# Altium project PCB_Project1.PrjPCB
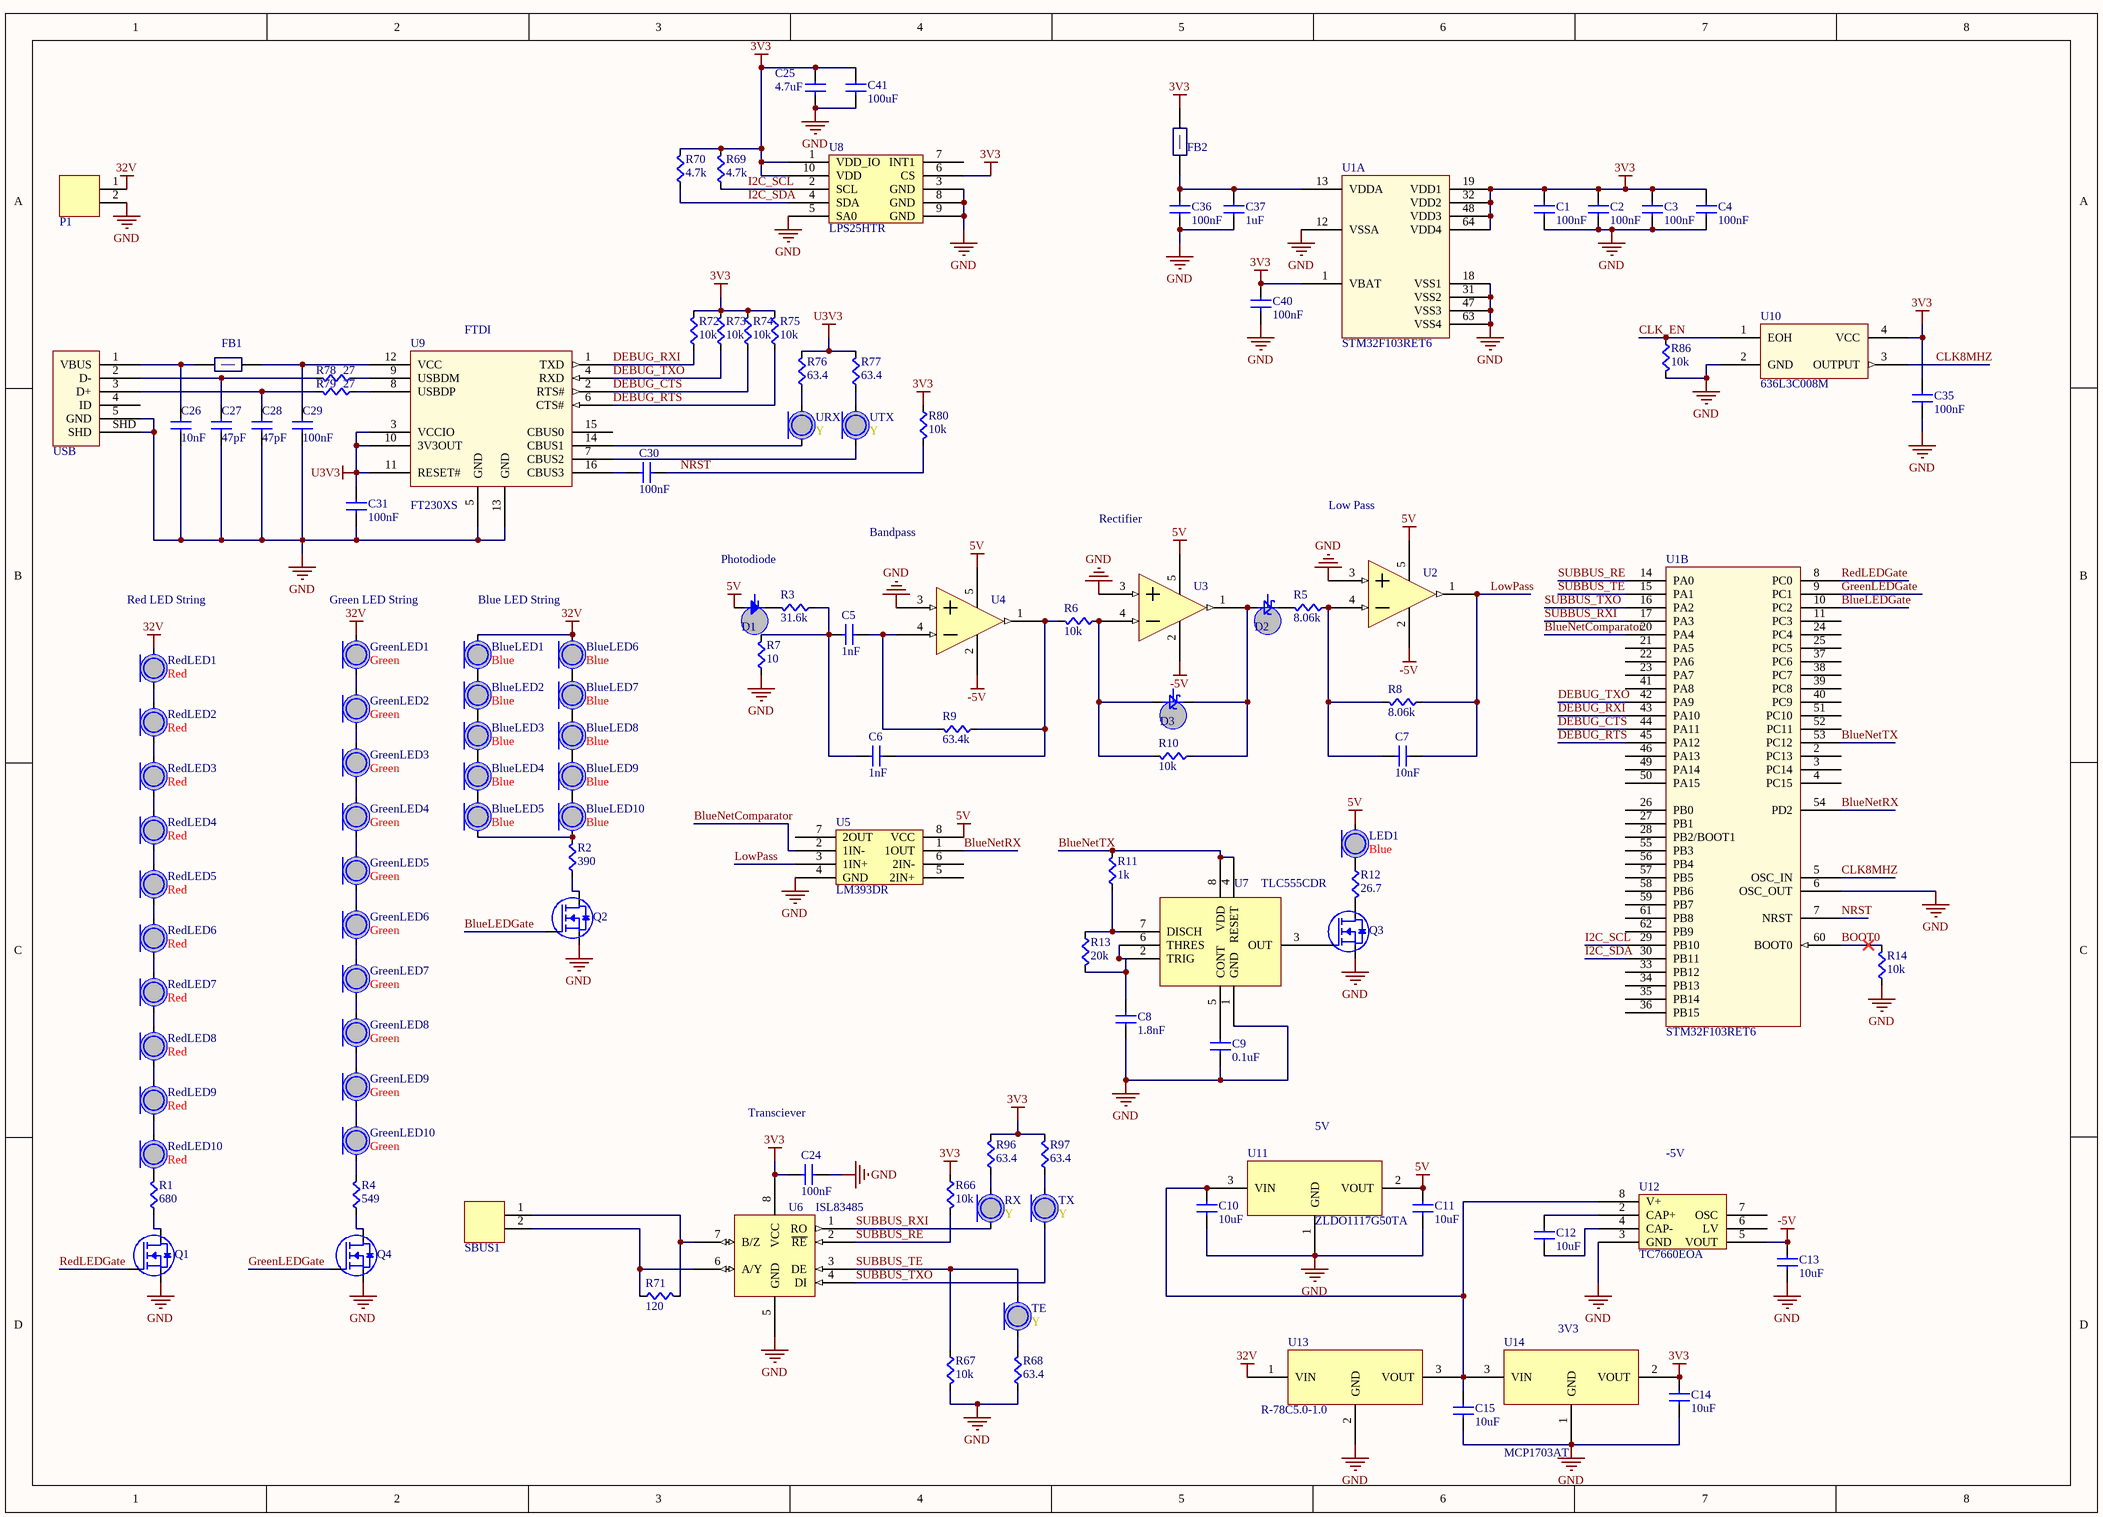
[diagram p0: DiverInterfaceBoard.SchDoc]
1 sheet, 122 parts. Net scope: global (net labels, ports and power ports of the same name join across sheets).
Board file: DiverInterfaceBoard.PcbDoc

## Sheet DiverInterfaceBoard.SchDoc
size A3

### Parts
BlueLED1  Color: Blue  [LED1206]  (hidden comment: LED)
BlueLED2  Color: Blue  [LED1206]  (hidden comment: LED)
BlueLED3  Color: Blue  [LED1206]  (hidden comment: LED)
BlueLED4  Color: Blue  [LED1206]  (hidden comment: LED)
BlueLED5  Color: Blue  [LED1206]  (hidden comment: LED)
BlueLED6  Color: Blue  [LED1206]  (hidden comment: LED)
BlueLED7  Color: Blue  [LED1206]  (hidden comment: LED)
BlueLED8  Color: Blue  [LED1206]  (hidden comment: LED)
BlueLED9  Color: Blue  [LED1206]  (hidden comment: LED)
BlueLED10  Color: Blue  [LED1206]  (hidden comment: LED)
C1  value 100nF  [CAPC0603]  (hidden comment: Cap)
C2  value 100nF  [CAPC0603]  (hidden comment: Cap)
C3  value 100nF  [CAPC0603]  (hidden comment: Cap)
C4  value 100nF  [CAPC0603]  (hidden comment: Cap)
C5  value 1nF  [CAPC0603]  (hidden comment: Cap)
C6  value 1nF  [CAPC0603]  (hidden comment: Cap)
C7  value 10nF  [CAPC0603]  (hidden comment: Cap)
C8  value 1.8nF  [CAPC0603]  (hidden comment: Cap)
C9  value 0.1uF  [CAPC0603]  (hidden comment: Cap)
C10  value 10uF  [CAPC0603]  (hidden comment: Cap)
C11  value 10uF  [CAPC0603]  (hidden comment: Cap)
C12  value 10uF  [CAPC0603]  (hidden comment: Cap)
C13  value 10uF  [CAPC0603]  (hidden comment: Cap)
C14  value 10uF  [CAPC0603]  (hidden comment: Cap)
C15  value 10uF  [CAPC0603]  (hidden comment: Cap)
C24  value 100nF  [CAPC0603]  (hidden comment: Cap)
C25  value 4.7uF  [CAPC0603]  (hidden comment: Cap)
C26  value 10nF  [CAPC0603]  (hidden comment: Cap)
C27  value 47pF  [CAPC0603]  (hidden comment: Cap)
C28  value 47pF  [CAPC0603]  (hidden comment: Cap)
C29  value 100nF  [CAPC0603]  (hidden comment: Cap)
C30  value 100nF  [CAPC0603]  (hidden comment: Cap)
C31  value 100nF  [CAPC0603]  (hidden comment: Cap)
C35  value 100nF  [CAPC0603]  (hidden comment: Cap)
C36  value 100nF  [CAPC0603]  (hidden comment: Cap)
C37  value 1uF  [CAPC0603]  (hidden comment: Cap)
C40  value 100nF  [CAPC0603]  (hidden comment: Cap)
C41  value 100uF  [CAPC1206]  (hidden comment: Cap)
D1  Diode  [TEMD5510FX01]  (value not drawn)
D2  Schottky  [1N5819HW-7-F]  (value not drawn)
D3  Schottky  [1N5819HW-7-F]  (value not drawn)
FB1  FBead  [RES0603]  (value not drawn)
FB2  FBead  [RES0603]  (value not drawn)
GreenLED1  Color: Green  [LED1206]  (hidden comment: LED)
GreenLED2  Color: Green  [LED1206]  (hidden comment: LED)
GreenLED3  Color: Green  [LED1206]  (hidden comment: LED)
GreenLED4  Color: Green  [LED1206]  (hidden comment: LED)
GreenLED5  Color: Green  [LED1206]  (hidden comment: LED)
GreenLED6  Color: Green  [LED1206]  (hidden comment: LED)
GreenLED7  Color: Green  [LED1206]  (hidden comment: LED)
GreenLED8  Color: Green  [LED1206]  (hidden comment: LED)
GreenLED9  Color: Green  [LED1206]  (hidden comment: LED)
GreenLED10  Color: Green  [LED1206]  (hidden comment: LED)
LED1  Color: Blue  [LED0603]  (hidden comment: LED)
P1  2-pin Vert Sherlock  [MOLEX-HDR-1X2-SHERLOCK-VERT]  (value not drawn)
Q1  FDN5630  [PowerSOT-3]  (value not drawn)
Q2  FDN5630  [PowerSOT-3]  (value not drawn)
Q3  FDN5630  [PowerSOT-3]  (value not drawn)
Q4  FDN5630  [PowerSOT-3]  (value not drawn)
R1  value 680  [RES0603]  (hidden comment: Res)
R2  value 390  [RES0603]  (hidden comment: Res)
R3  value 31.6k  [RES0603]  (hidden comment: Res)
R4  value 549  [RES0603]  (hidden comment: Res)
R5  value 8.06k  [RES0603]  (hidden comment: Res)
R6  value 10k  [RES0603]  (hidden comment: Res)
R7  value 10  [RES0603]  (hidden comment: Res)
R8  value 8.06k  [RES0603]  (hidden comment: Res)
R9  value 63.4k  [RES0603]  (hidden comment: Res)
R10  value 10k  [RES0603]  (hidden comment: Res)
R11  value 1k  [RES0603]  (hidden comment: Res)
R12  value 26.7  [RES0603]  (hidden comment: Res)
R13  value 20k  [RES0603]  (hidden comment: Res)
R14  value 10k  [RES0603]  (hidden comment: Res)
R66  value 10k  [RES0603]  (hidden comment: Res)
R67  value 10k  [RES0603]  (hidden comment: Res)
R68  value 63.4  [RES0603]  (hidden comment: Res)
R69  value 4.7k  [RES0603]  (hidden comment: Res)
R70  value 4.7k  [RES0603]  (hidden comment: Res)
R71  value 120  [RES0603]  (hidden comment: Res)
R72  value 10k  [RES0603]  (hidden comment: Res)
R73  value 10k  [RES0603]  (hidden comment: Res)
R74  value 10k  [RES0603]  (hidden comment: Res)
R75  value 10k  [RES0603]  (hidden comment: Res)
R76  value 63.4  [RES0603]  (hidden comment: Res)
R77  value 63.4  [RES0603]  (hidden comment: Res)
R78  value 27  [RES0603]  (hidden comment: Res)
R79  value 27  [RES0603]  (hidden comment: Res)
R80  value 10k  [RES0603]  (hidden comment: Res)
R86  value 10k  [RES0603]  (hidden comment: Res)
R96  value 63.4  [RES0603]  (hidden comment: Res)
R97  value 63.4  [RES0603]  (hidden comment: Res)
RedLED1  Color: Red  [LED1206]  (hidden comment: LED)
RedLED2  Color: Red  [LED1206]  (hidden comment: LED)
RedLED3  Color: Red  [LED1206]  (hidden comment: LED)
RedLED4  Color: Red  [LED1206]  (hidden comment: LED)
RedLED5  Color: Red  [LED1206]  (hidden comment: LED)
RedLED6  Color: Red  [LED1206]  (hidden comment: LED)
RedLED7  Color: Red  [LED1206]  (hidden comment: LED)
RedLED8  Color: Red  [LED1206]  (hidden comment: LED)
RedLED9  Color: Red  [LED1206]  (hidden comment: LED)
RedLED10  Color: Red  [LED1206]  (hidden comment: LED)
RX  Color: Y  [LED0805]  (hidden comment: LED)
SBUS1  2-pin Horz Sherlock  [MOLEX-HDR-1X2-SHERLOCK-HORZ]  (value not drawn)
TE  Color: Y  [LED0805]  (hidden comment: LED)
TX  Color: Y  [LED0805]  (hidden comment: LED)
U1  STM32F103RET6  [STM32F103RxTx]  (parts A,B of 2)
U2  MCP6L01  [MCP6L01R]  (value not drawn)
U3  MCP6L01  [MCP6L01R]  (value not drawn)
U4  MCP6L01  [MCP6L01R]  (value not drawn)
U5  LM393DR  [LM393DR]
U6  ISL83485  [ISL8348xIBZ]
U7  TLC555CDR  [TLC555CDR]
U8  LPS25HTR  [LPS25HTR]
U9  FT230XS  [FT230XS]
U10  636L3C008M  [636L3C]
U11  ZLDO1117G50TA  [ZLDO1117G50TA]
U12  TC7660EOA  [TC7660EOA]
U13  R-78C5.0-1.0  [R-78C5.0-1.0]
U14  MCP1703AT  [MCP1703AT-xx02EDB]
URX  Color: Y  [LED0805]  (hidden comment: LED)
USB  UX60SC-MB-5ST  [UX60SC-MB-5ST]  (value not drawn)
UTX  Color: Y  [LED0805]  (hidden comment: LED)

### Nets
3V3: C1.1(A) C2.1(A) C3.1(A) C4.1(A) C14.1(A) C24.2(B) C25.1(A) C35.1(A) C40.1(A) C41.1(A) FB2.2(B) R66.1(A) R69.1(A) R70.1(A) R72.1(A) R73.1(A) R74.1(A) R75.1(A) R80.1(A) R96.1(A) R97.1(A) U1.1(VBAT) U1.19(VDD1) U1.32(VDD2) U1.48(VDD3) U1.64(VDD4) U6.8(VCC) U8.1(VDD_IO) U8.6(CS) U8.10(VDD) U10.4(VCC) U14.2(VOUT)
5V: C11.1(A) D1.A LED1.A U2.5(VDD) U3.5(VDD) U4.5(VDD) U5.8(VCC) U11.2(VOUT)
32V: BlueLED1.A BlueLED6.A GreenLED1.A P1.1 RedLED1.A U13.1(VIN)
-5V: C13.1(A) U2.2(VSS) U3.2(VSS) U4.2(VSS) U12.5(VOUT)
GND: C1.2(B) C2.2(B) C3.2(B) C4.2(B) C8.2(B) C9.2(B) C10.2(B) C11.2(B) C13.2(B) C14.2(B) C15.2(B) C24.1(A) C25.2(B) C26.2(B) C27.2(B) C28.2(B) C29.2(B) C31.2(B) C35.2(B) C36.2(B) C37.2(B) C40.2(B) C41.2(B) P1.2 Q1.S Q2.S Q3.S Q4.S R7.2(B) R14.2(B) R67.2(B) R68.2(B) R86.1(A) U1.6(OSC_OUT) U1.12(VSSA) U1.18(VSS1) U1.31(VSS2) U1.47(VSS3) U1.63(VSS4) U2.3(VIN+) U3.3(VIN+) U4.3(VIN+) U5.4(GND) U6.5(GND) U7.1(GND) U8.3(GND) U8.5(SA0) U8.8(GND) U8.9(GND) U9.5(GND) U9.13(GND) U10.2(GND) U11.1(GND) U12.3(GND) U13.2(GND) U14.1(GND) USB.5(GND) USB.SHD
U3V3: C31.1(A) R76.1(A) R77.1(A) U9.3(VCCIO) U9.10(3V3OUT) U9.11(RESET#)
BlueLEDGate: Q2.G U1.10(PC2)
BlueNetComparator: U1.20(PA4) U5.2(1IN-)
BlueNetRX: U1.54(PD2) U5.1(1OUT)
BlueNetTX: R11.1(A) U1.53(PC12) U7.4(RESET) U7.8(VDD)
BOOT0: R14.1(A) U1.60(BOOT0)
CLK8MHZ: U1.5(OSC_IN) U10.3(OUTPUT)
CLK_EN: R86.2(B) U10.1(EOH)
DEBUG_CTS: R74.2(B) U1.44(PA11) U9.2(RTS#)
DEBUG_RTS: R75.2(B) U1.45(PA12) U9.6(CTS#)
DEBUG_RXI: R72.2(B) U1.43(PA10) U9.1(TXD)
DEBUG_TXO: R73.2(B) U1.42(PA9) U9.4(RXD)
GreenLEDGate: Q4.G U1.9(PC1)
I2C_SCL: R69.2(B) U1.29(PB10) U8.2(SCL)
I2C_SDA: R70.2(B) U1.30(PB11) U8.4(SDA)
LowPass: C7.2(B) R8.2(B) U2.1(VOUT) U5.3(1IN+)
NRST: C30.2(B) R80.2(B) U1.7(NRST)
RedLEDGate: Q1.G U1.8(PC0)
SUBBUS_RE: R66.2(B) U1.14(PA0) U6.2(~{RE})
SUBBUS_RXI: RX.C U1.17(PA3) U6.1(RO)
SUBBUS_TE: R67.1(A) TE.A U1.15(PA1) U6.3(DE)
SUBBUS_TXO: TX.C U1.16(PA2) U6.4(DI)
NetBlueLED1_C: BlueLED1.C BlueLED2.A
NetBlueLED2_C: BlueLED2.C BlueLED3.A
NetBlueLED3_C: BlueLED3.C BlueLED4.A
NetBlueLED4_C: BlueLED4.C BlueLED5.A
NetBlueLED5_C: BlueLED5.C BlueLED10.C R2.1(A)
NetBlueLED6_C: BlueLED6.C BlueLED7.A
NetBlueLED7_C: BlueLED7.C BlueLED8.A
NetBlueLED8_C: BlueLED8.C BlueLED9.A
NetBlueLED9_C: BlueLED9.C BlueLED10.A
NetC5_1: C5.1(A) C6.1(A) R3.2(B) R7.1(A)
NetC5_2: C5.2(B) R9.1(A) U4.4(VIN-)
NetC6_2: C6.2(B) R6.1(A) R9.2(B) U4.1(VOUT)
NetC7_1: C7.1(A) R5.2(B) R8.1(A) U2.4(VIN-)
NetC8_1: C8.1(A) R13.1(A) U7.2(TRIG) U7.6(THRES)
NetC9_1: C9.1(A) U7.5(CONT)
NetC10_1: C10.1(A) C15.1(A) U11.3(VIN) U12.8(V+) U13.3(VOUT) U14.3(VIN)
NetC12_1: C12.1(A) U12.2(CAP+)
NetC12_2: C12.2(B) U12.4(CAP-)
NetC26_1: C26.1(A) FB1.2(B) USB.1(VBUS)
NetC27_1: C27.1(A) R78.1(A) USB.2(D-)
NetC28_1: C28.1(A) R79.1(A) USB.3(D+)
NetC29_1: C29.1(A) FB1.1(A) U9.12(VCC)
NetC30_1: C30.1(A) U9.16(CBUS3)
NetC36_1: C36.1(A) C37.1(A) FB2.1(A) U1.13(VDDA)
NetD1_C: D1.C R3.1(A)
NetD2_A: D2.A D3.C R10.2(B) U3.1(VOUT)
NetD2_C: D2.C R5.1(A)
NetD3_A: D3.A R6.2(B) R10.1(A) U3.4(VIN-)
NetGreenLED1_C: GreenLED1.C GreenLED2.A
NetGreenLED2_C: GreenLED2.C GreenLED3.A
NetGreenLED3_C: GreenLED3.C GreenLED4.A
NetGreenLED4_C: GreenLED4.C GreenLED5.A
NetGreenLED5_C: GreenLED5.C GreenLED6.A
NetGreenLED6_C: GreenLED6.C GreenLED7.A
NetGreenLED7_C: GreenLED7.C GreenLED8.A
NetGreenLED8_C: GreenLED8.C GreenLED9.A
NetGreenLED9_C: GreenLED9.C GreenLED10.A
NetGreenLED10_C: GreenLED10.C R4.1(A)
NetLED1_C: LED1.C R12.2(B)
NetQ1_D: Q1.D R1.2(B)
NetQ2_D: Q2.D R2.2(B)
NetQ3_D: Q3.D R12.1(A)
NetQ3_G: Q3.G U7.3(OUT)
NetQ4_D: Q4.D R4.2(B)
NetR1_1: R1.1(A) RedLED10.C
NetR11_2: R11.2(B) R13.2(B) U7.7(DISCH)
NetR68_1: R68.1(A) TE.C
NetR71_1: R71.1(A) SBUS1.1 U6.7(B/Z)
NetR71_2: R71.2(B) SBUS1.2 U6.6(A/Y)
NetR76_2: R76.2(B) URX.A
NetR77_2: R77.2(B) UTX.A
NetR78_2: R78.2(B) U9.9(USBDM)
NetR79_2: R79.2(B) U9.8(USBDP)
NetR96_2: R96.2(B) RX.A
NetR97_2: R97.2(B) TX.A
NetRedLED1_C: RedLED1.C RedLED2.A
NetRedLED2_C: RedLED2.C RedLED3.A
NetRedLED3_C: RedLED3.C RedLED4.A
NetRedLED4_C: RedLED4.C RedLED5.A
NetRedLED5_C: RedLED5.C RedLED6.A
NetRedLED6_C: RedLED6.C RedLED7.A
NetRedLED7_C: RedLED7.C RedLED8.A
NetRedLED8_C: RedLED8.C RedLED9.A
NetRedLED9_C: RedLED9.C RedLED10.A
NetU9_7: U9.7(CBUS2) UTX.C
NetU9_14: U9.14(CBUS1) URX.C

Not connected (* = marked no-connect by the designer): U1 2(PC13) 3(PC14) 4(PC15) 11(PC3) 21(PA5) 22(PA6) 23(PA7) 24(PC4) 25(PC5) 26(PB0) 27(PB1) 28(PB2/BOOT1) 33(PB12) 34(PB13) 35(PB14) 36(PB15) 37(PC6) 38(PC7) 39(PC8) 40(PC9) 41(PA8) 46(PA13) 49(PA14) 50(PA15) 51(PC10) 52(PC11) 55(PB3) 56(PB4) 57(PB5) 58(PB6) 59(PB7) 61(PB8) 62(PB9); U5 5(2IN+) 6(2IN-) 7(2OUT); U8 7(INT1); U9 15(CBUS0); U12 6(LV) 7(OSC); USB 4(ID)

### Notes on the sheet
- (near U9) FTDI
- Rectifier
- Low Pass
- Photodiode
- Bandpass
- (near RedLED1) Red LED String
- (near GreenLED1) Green LED String
- Blue LED String
- Transciever
- 5V
- (near U12) -5V
- (near U14) 3V3

### Library data of the parts
C40 = Cap: Manufacturer: Kemet; Manufacturer PN: C0603C104K8RACTU; Distributor: Digikey; Distributor PN: 399-1095-1-ND; Supplier 1: Digi-Key; Supplier Part Number 1: 1276-1000-1-ND
D1 = Diode: Standard Diode Template; Supplier: Digi-Key; Supplier Part Number: TEMD5510FX01CT-ND
D2 D3 = Schottky: Schottky Diode Template
FB1 FB2 = FBead: Ferrite Bead; Supplier 1: Digi-Key; Supplier Part Number 1: 445-2988-1-ND
P1 = MOLEX-HDR-1x2-SHERLOCK_VERT: Header, Molex, 2mm Pitch Sherlock Header, Single Row, Vertical, 2 Circuits, Length 3.3mm, 0353620250; Manufacturer Part Number: *; Order Part Number: *
Q1-Q4 = FDN5630: 60V N-Channel PowerTrench MOSFET; Supplier 1: Digi-Key; Supplier Part Number 1: FDN5630CT-ND
SBUS1 = MOLEX-HDR-1x2-SHERLOCK_RA: Header, Molex, 2mm Pitch Sherlock Header, Single Row, Horizontal, 2 Circuits, Length 3.3mm,  0353630260; Manufacturer: Molex Inc; Manufacturer Part Number: 0353630260; Supplier Part Number: WM18931-ND; Supplier: Digi-Key
U1 = STM32F103RET6: Mainstream Performance line, ARM Cortex-M3 MCU
U2-U4 = MCP6L01: Op Amp Rail-to-Rail 1Mhz; Supplier 1: Digi-Key; Supplier Part Number 1: MCP6L01T-E/OTCT-ND
U5 = LM393DR: LM393DR Comparator; Supplier 1: Digi-key; Supplier Part Number 1: 296-1015-1-ND
U6 = ISL83485: 3.3V RS485 Transceiver; Supplier 1: Digi-Key; Supplier Part Number 1: ISL83485IBZ-ND
U7 = TLC555CDR: IC OSC MONO TIMING 2.1MHZ 8-SOIC; Supplier 1: Digi-Key; Supplier Part Number 1: 296-1336-1-ND
U8 = LPS25HTR: IC MEMS PRESSURE SENSOR 10HCLGA; Supplier: Digikey; Supplier Part Number: 497-14380-1-ND
U9 = FT230XS: USB To Basic UART IC; Supplier 1: Digi-Key; Supplier Part Number 1: 768-1154-5-ND
U10 = 636L3C: HCMOS/TTL Clock Oscillator; Supplier 1: Digi-Key; Supplier Part Number 1: CTX1005CT-ND
U11 = ZLDO1117G50TA: IC REG LDO 5V 1A SOT223-3; Supplier 1: Digi-Key; Supplier Part Number 1: ZLDO1117G50DICT-ND
U12 = TC7660EOA: IC REG SWITCHD CAP INV ADJ 8SOIC; Supplier 1: Digi-key; Supplier Part Number 1: TC7660EOA-ND
U13 = R-78C5.0-1.0: CONV DC/DC 1A 5V OUT SIP VERT; Supplier 1: Digi-Key; Supplier Part Number 1: 945-1037-ND
U14 = MCP1703AT: 250 mA, 16V, Low Quiescent Current LDO Regulator; Supplier 1: Digi-Key; Supplier Part Number 1: MCP1703AT-3302E/CBCT-ND
USB = UX60SC-MB-5ST: USB Mini B Metal Shield SMT; Supplier 1: Digi-Key; Supplier Part Number 1: H11671CT-ND
BlueLED1-BlueLED10 GreenLED1-GreenLED10 LED1 RedLED1-RedLED10 RX TE TX URX UTX = LED: Supplier 1: Digi-Key
  BlueLED1-BlueLED10: Supplier Part Number 1: 754-1442-1-ND
  GreenLED1-GreenLED10: Supplier Part Number 1: 754-1154-1-ND
  LED1: Supplier Part Number 1: 754-1122-1-ND
  RedLED1-RedLED10: Supplier Part Number 1: 754-1158-1-ND
  RX TE TX URX UTX: Supplier Part Number 1: 160-1416-1-ND
C1-C15 C24-C31 C35-C37 C41 = Cap: Supplier 1: Digi-Key
  C1-C4 C24 C29-C31 C35-C37: Supplier Part Number 1: 1276-1000-1-ND
  C5 C6: Supplier Part Number 1: 490-6377-1-ND
  C7: Supplier Part Number 1: 399-1092-1-ND
  C8: Supplier Part Number 1: 490-1457-1-ND
  C9: Supplier Part Number 1: 1276-1061-1-ND
  C10-C15: Supplier Part Number 1: 445-11185-1-ND
  C25: Supplier Part Number 1: 1276-2087-1-ND
  C26: Supplier Part Number 1: 445-1311-1-ND
  C27 C28: Supplier Part Number 1: 445-1277-1-ND
  C41: Supplier Part Number 1: 587-1963-1-ND
R1-R14 R66-R80 R86 R96 R97 = Res: Supplier 1: Digi-Key
  R1: Supplier Part Number 1: P680GCT-ND
  R2: Supplier Part Number 1: RMCF0603JT390RCT-ND
  R3: Supplier Part Number 1: CR0603-FX-3162ELFCT-ND
  R4: Supplier Part Number 1: P549HCT-ND
  R5 R8: Supplier Part Number 1: P8.06KHCT-ND
  R6 R10: Supplier Part Number 1: RMCF0603FT10K0CT-ND
  R7: Supplier Part Number 1: MCT0603-10.0-CFCT-ND
  R9: Supplier Part Number 1: RMCF0603FT63K4CT-ND
  R11: Supplier Part Number 1: RNCP0603FTD1K00CT-ND
  R12: Supplier Part Number 1: P26.7HCT-ND
  R13: Supplier Part Number 1: RNCP0603FTD20K0CT-ND
  R14 R66 R67 R72-R75 R80 R86: Supplier Part Number 1: RMCF0603JT10K0CT-ND
  R68 R76 R77 R96 R97: Supplier Part Number 1: RMCF0603FT63R4CT-ND
  R69 R70: Supplier Part Number 1: RMCF0603JT4K70CT-ND
  R71: Supplier Part Number 1: RHM120HCT-ND
  R78 R79: Supplier Part Number 1: RMCF0603JT27R0CT-ND